# Altium schematic sheet overview.SchDoc
size A4
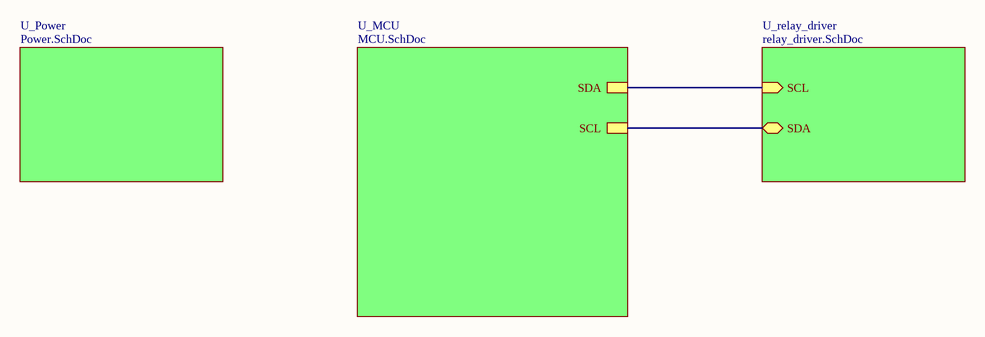
[diagram p0: overview.SchDoc]

## Sub-sheets
U_MCU = MCU.SchDoc: SDA, SCL
U_Power = Power.SchDoc: no entries
U_relay_driver = relay_driver.SchDoc: SCL (in), SDA (bidir)

## Nets
(unnamed): sheet U_MCU/SDA, sheet U_relay_driver/SCL
(unnamed): sheet U_MCU/SCL, sheet U_relay_driver/SDA